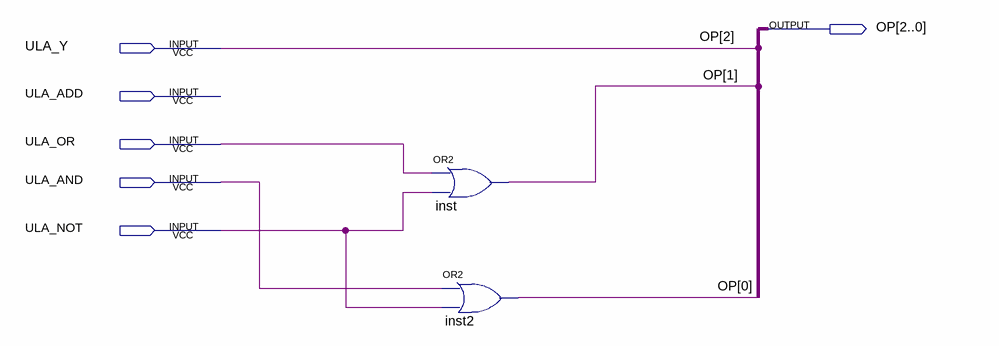
[diagram p0: schematic sheet]
// Quartus schematic decodULAop.bdf as structural Verilog: 2 symbols, 6 pins
module decodULAop (
  input  ULA_Y,
  input  ULA_ADD,
  input  ULA_OR,
  input  ULA_AND,
  input  ULA_NOT,
  output [2:0] OP
);

  or inst (OP[1], ULA_OR, ULA_NOT);
  or inst2 (OP[0], ULA_AND, ULA_NOT);

  assign OP[2] = ULA_Y;
endmodule
